# Altium project PCB_Project Battery 3.7v v2.PrjPcb
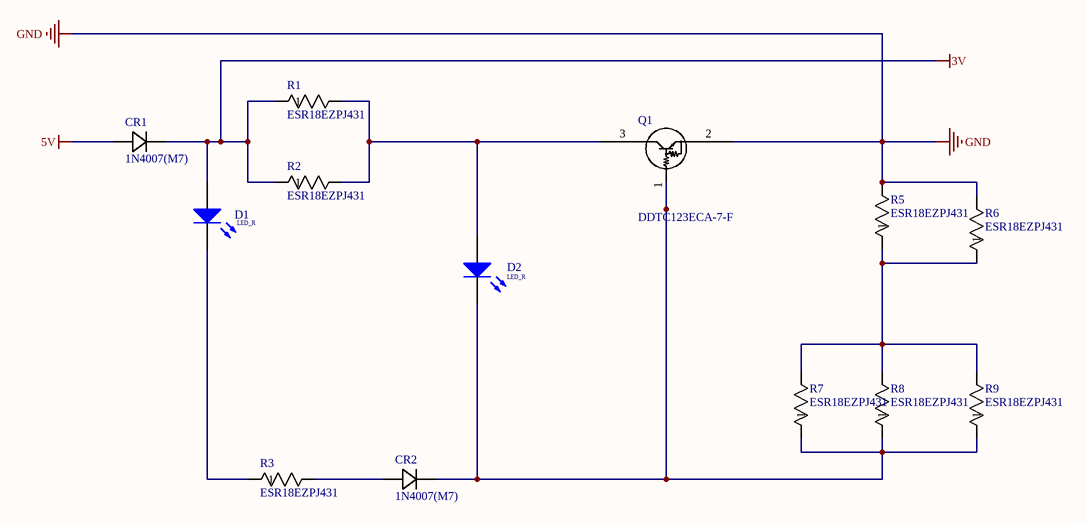
[diagram p0: Battery 3.7v Shematic.SchDoc]
1 sheet, 13 parts. Net scope: global (net labels, ports and power ports of the same name join across sheets).
Board file: Battery 3.7 PCB.PcbDoc

## Sheet Battery 3.7v Shematic.SchDoc
size A4; SheetNumber: 1; SheetTotal: 1

### Parts
CR1  1N4007(M7)  [CR_1N4007(M7)_YTS]
CR2  1N4007(M7)  [CR_1N4007(M7)_YTS]
D1  LED_R  [C1206]
D2  LED_R  [C1206]
Q1  DDTC123ECA-7-F  [SOT23_DIO]
R1  ESR18EZPJ431  [RES_R1206_ROM]
R2  ESR18EZPJ431  [RES_R1206_ROM]
R3  ESR18EZPJ431  [RES_R1206_ROM]
R5  ESR18EZPJ431  [RES_R1206_ROM]
R6  ESR18EZPJ431  [RES_R1206_ROM]
R7  ESR18EZPJ431  [RES_R1206_ROM]
R8  ESR18EZPJ431  [RES_R1206_ROM]
R9  ESR18EZPJ431  [RES_R1206_ROM]

### Nets
3V: CR1.1 D1.1(A) R1.1 R2.1
5V: CR1.2
GND: Q1.2 R5.2 R6.2
NetCR2_1: CR2.1 D2.2(K) Q1.1 R7.1 R8.1 R9.1
NetCR2_2: CR2.2 R3.2
NetD1_2: D1.2(K) R3.1
NetD2_1: D2.1(A) Q1.3 R1.2 R2.2
NetR5_1: R5.1 R6.1 R7.2 R8.2 R9.2

### Library data of the parts
CR1 CR2 = 1N4007(M7): No Description Available; Mfr_Name: UMW(Youtai Semiconductor Co., Ltd.); Type: DEV; Copyright: Copyright (C) 2022 Ultra Librarian. All rights reserved.; Manufacturer_Part_Number: 1N4007(M7); RefDes: RefDes
D1 D2 = LED0: Typical INFRARED GaAs LED; Published: 8-Jun-2000; LatestRevisionDate: 08-Jul-2005; LatestRevisionNote: Mech Layer 1 removed.; PackageReference: LED-0; Publisher: Altium Limited; PackageDescription: LED; 2 Leads
Q1 = DDTC123ECA-7-F: No Description Available; Mfr_Name: Diodes Inc; Type: DEV; Copyright: Copyright (C) 2022 Ultra Librarian. All rights reserved.; Manufacturer_Part_Number: DDTC123ECA-7-F; RefDes: RefDes
R1-R3 R5-R9 = ESR18EZPJ431: No Description Available; Mfr_Name: ROHM Semiconductor; Copyright: Copyright (C) 2022 Ultra Librarian. All rights reserved.; Manufacturer_Part_Number: ESR18EZPJ431; RefDes: RefDes; Type: DEV